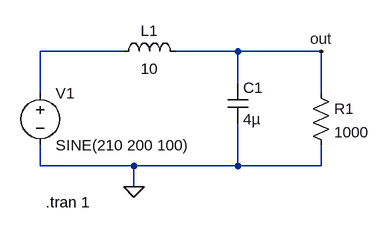
[diagram p0: schematic LowPassFilter1.asc]
LowPassFilter1.asc, the LTspice schematic file:
Version 4
SHEET 1 880 680
WIRE 208 80 80 80
WIRE 384 80 288 80
WIRE 512 80 384 80
WIRE 384 128 384 80
WIRE 80 144 80 80
WIRE 512 144 512 80
WIRE 80 256 80 224
WIRE 224 256 80 256
WIRE 384 256 384 192
WIRE 384 256 224 256
WIRE 512 256 512 224
WIRE 512 256 384 256
WIRE 224 288 224 256
FLAG 224 288 0
FLAG 512 80 out
SYMBOL voltage 80 128 R0
WINDOW 123 0 0 Left 0
WINDOW 39 0 0 Left 0
SYMATTR InstName V1
SYMATTR Value SINE(210 200 100)
SYMBOL ind 192 96 R270
WINDOW 0 32 56 VTop 2
WINDOW 3 5 56 VBottom 2
SYMATTR InstName L1
SYMATTR Value 10
SYMBOL res 496 128 R0
SYMATTR InstName R1
SYMATTR Value 1000
SYMBOL cap 368 128 R0
SYMATTR InstName C1
SYMATTR Value 4µ
TEXT 88 312 Left 2 !.tran 1

The netlist it stands for:
* LowPassFilter1.asc
V1 N001 0 SINE(210 200 100)
L1 N001 out 10
R1 out 0 1000
C1 out 0 4µ
.tran 1
.backanno
.end